# EasyEDA Pro project AE.eprj

# Schematic esquematico-controladora
Board Name: Controladora; Create Date: 2026-03-11; Page Name: FolhaControladora; Project Name: AE; Schematic Name: esquematico-controladora; Update Date: 2026-03-11; Company: EasyEDA.com; Page Size: A4; Version: V1.0
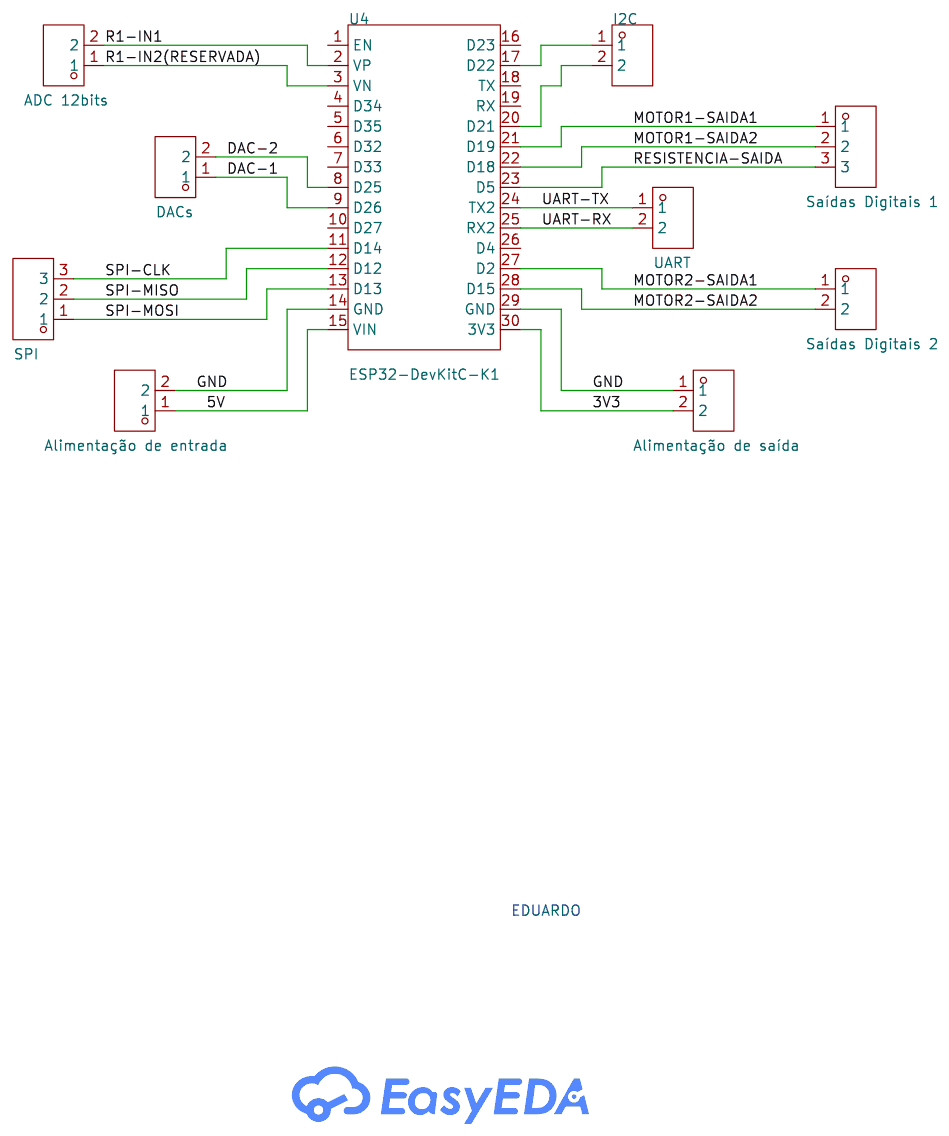
[diagram p0: schematic sheet]

## Parts
ADC12bits  ADC 12bits  [CONN-TH_P5.08_KF128L-5.08-2P]
Alimentaçãodeentrada  Alimentação de entrada  [CONN-TH_P5.08_KF128L-5.08-2P]
Alimentaçãodesaída  Alimentação de saída  [CONN-TH_P5.08_KF128L-5.08-2P]
DACs  DACs  [CONN-TH_P5.08_KF128L-5.08-2P]
I2C  I2C  [CONN-TH_P5.08_KF128L-5.08-2P]
SaídasDigitais1  Saídas Digitais 1  [CONN-TH_3P-P5.00_KF128-5.0-3P]
SaídasDigitais2  Saídas Digitais 2  [CONN-TH_P5.08_KF128L-5.08-2P]
SPI  SPI  [CONN-TH_3P-P5.00_KF128-5.0-3P]
U4  ESP32-DevKitC-K1  [BULETM-SMD_ESP32-DEVKITC]
UART  UART  [CONN-TH_P5.08_KF128L-5.08-2P]

## Library data of the parts
ADC12bits Alimentaçãodeentrada Alimentaçãodesaída DACs I2C SaídasDigitais2 UART = KF128L-5.08-2P: LCSC Part Name: 1x2P 5.08mm 直插 排数:1 每排P数:2; Supplier Part: C474940; Manufacturer: KEFA(科发); Supplier Footprint: 插件,P=5.08mm; JLCPCB Part Class: Extended Part; Datasheet: https://item.szlcsc.com/datasheet/KF128L-5.08-2P/481558.html; Supplier: LCSC; Number of Positions or Pins: 1x2P; Pitch: 5.08mm; Color: Green; Mounting Type: Through Hole; Number of Pins: 2P; Number of Rows: 1; Number of PINs Per Row: 2; Current Rating: 24A; Voltage Rating (Max): 250V; Wire Gauge - AWG: 12~22; Wire Gauge - mm2: 2.5; Operating Temperature: -40℃~+105℃
SaídasDigitais1 = KF128-5.0-3P: LCSC Part Name: 1x3P 5mm 直插 排数:1 每排P数:3; Supplier Part: C474951; Manufacturer: KEFA(科发); Manufacturer Part: SPI; Supplier Footprint: 插件,P=5mm; JLCPCB Part Class: Extended Part; Datasheet: https://item.szlcsc.com/datasheet/KF128-5.0-3P/481569.html; Supplier: LCSC; Number of Positions or Pins: 1x3P; Pitch: 5mm; Color: Green; Mounting Type: Through Hole; Number of Pins: 3P; Number of Rows: 1; Number of PINs Per Row: 3; Current Rating: 24A; Voltage Rating (Max): 250V; Wire Gauge - AWG: 12~22; Wire Gauge - mm2: 2.5; Operating Temperature: -40℃~+105℃
SPI = KF128-5.0-3P: LCSC Part Name: 1x3P 5mm 直插 排数:1 每排P数:3; Supplier Part: C474951; Manufacturer: KEFA(科发); Supplier Footprint: 插件,P=5mm; JLCPCB Part Class: Extended Part; Datasheet: https://item.szlcsc.com/datasheet/KF128-5.0-3P/481569.html; Supplier: LCSC; Number of Positions or Pins: 1x3P; Pitch: 5mm; Color: Green; Mounting Type: Through Hole; Number of Pins: 3P; Number of Rows: 1; Number of PINs Per Row: 3; Current Rating: 24A; Voltage Rating (Max): 250V; Wire Gauge - AWG: 12~22; Wire Gauge - mm2: 2.5; Operating Temperature: -40℃~+105℃
U4 = ESP32-DevKitC: CPU:- ROM Size:- Number of I/O: USB:- WIFI Protocols:- Bluetooth:- Ethernet:- Audio & Video Interface:- Multimedia Support:- Card Type:- Power Supply Type:- Power Supply:- POE Support:- Resolution:- Temperature Range:-; LCSC Part Name: 开发板; Supplier Part: C571180; Manufacturer: ESPRESSIF(乐鑫); JLCPCB Part Class: Extended Part; Datasheet: https://atta.szlcsc.com/upload/public/pdf/source/20200521/C529586_D6FCDAFCFF160B3EDDF7DF28D600699D.pdf; Supplier: LCSC

## Nets
3V3: Alimentaçãodesaída.2 U4.30(3V3)
5V: Alimentaçãodeentrada.1 U4.15(VIN)
GND: Alimentaçãodeentrada.2 Alimentaçãodesaída.1 U4.14(GND) U4.29(GND)
DAC-1: DACs.1 U4.9(D26)
DAC-2: DACs.2 U4.8(D25)
MOTOR1-SAIDA1: SaídasDigitais1.1 U4.21(D19)
MOTOR1-SAIDA2: SaídasDigitais1.2 U4.22(D18)
MOTOR2-SAIDA1: SaídasDigitais2.1 U4.27(D2)
MOTOR2-SAIDA2: SaídasDigitais2.2 U4.28(D15)
R1-IN1: ADC12bits.2 U4.2(VP)
R1-IN2(RESERVADA): ADC12bits.1 U4.3(VN)
RESISTENCIA-SAIDA: SaídasDigitais1.3 U4.23(D5)
SPI-CLK: SPI.3 U4.11(D14)
SPI-MISO: SPI.2 U4.12(D12)
SPI-MOSI: SPI.1 U4.13(D13)
UART-RX: U4.25(RX2) UART.2
UART-TX: U4.24(TX2) UART.1
$1N2586: I2C.1 U4.17(D22)
$1N2592: I2C.2 U4.20(D21)

Not connected (* = marked no-connect by the designer): U4 1(EN) 4(D34) 5(D35) 6(D32) 7(D33) 10(D27) 16(D23) 18(TX) 19(RX) 26(D4)

## Notes on the sheet
- EDUARDO

# Schematic Condicionador
Board Name: PCB5; Create Date: 2026-06-05; Page Name: FolhaCondicionador; Project Name: AE; Schematic Name: Condicionador; Update Date: 2026-06-12; Company: EasyEDA.com; Page Size: A4; Version: V1.0
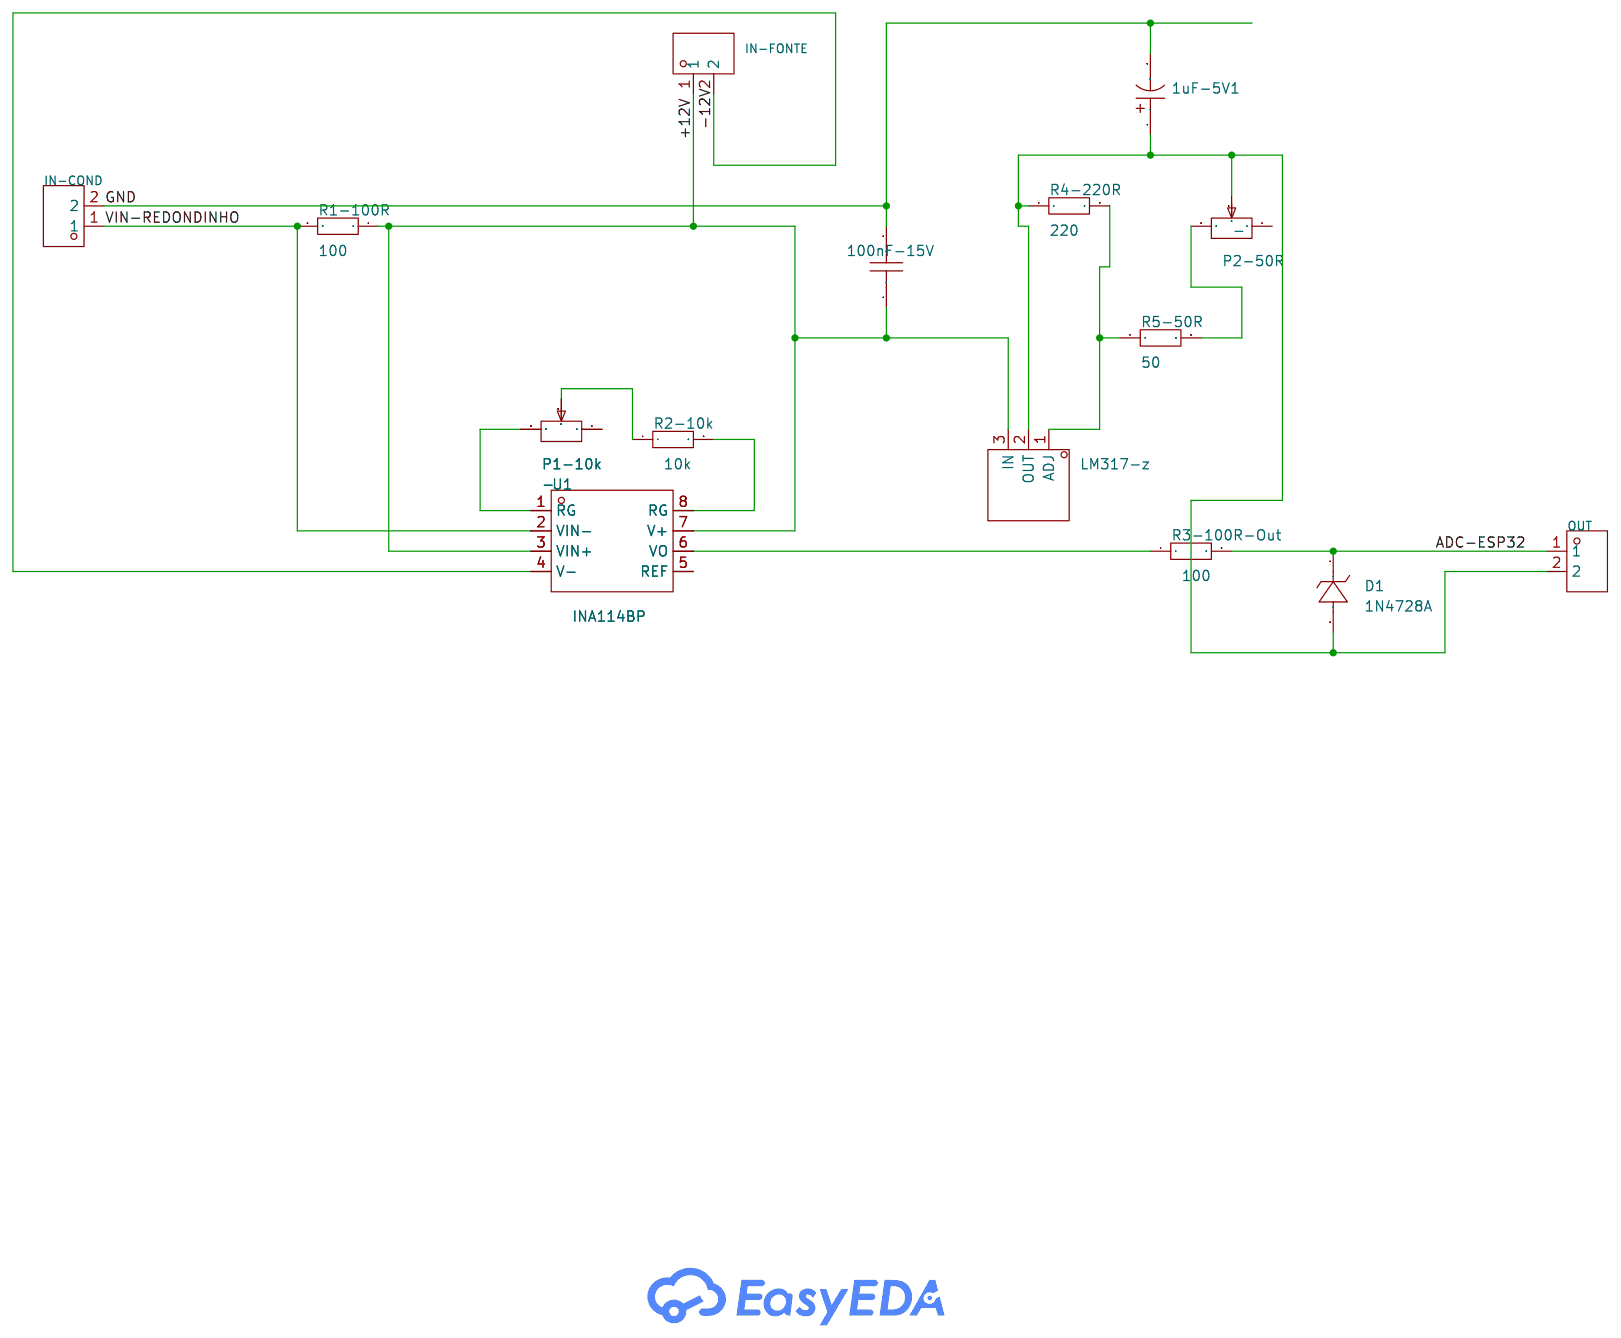
[diagram p1: schematic sheet]

## Parts
1uF-5V1  47uF  [CAP-TH_BD6.3-P2.50-D0.6-FD-H11.0]
100nF-15V  TCC0805X7R106K160FTM  [C0805]
D1  1N4728A  [DO-41_BD2.4-L4.7-P8.70-D0.9-RD]
IN-COND  KF128L-5.08-2P  [CONN-TH_P5.08_KF128L-5.08-2P]
IN-FONTE  KF128L-5.08-2P  [CONN-TH_P5.08_KF128L-5.08-2P]
LM317-z  LM317  [TO-220-3_L10.0-W4.5-P2.54-L]
OUT  KF128L-5.08-2P  [CONN-TH_P5.08_KF128L-5.08-2P]
P1-10k  -  [RES-ADJ-TH_3296W]
P2-50R  -  [RES-ADJ-TH_3296W]
R1-100R  100  [R0603]
R2-10k  10k  [R0603]
R3-100R-Out  100  [R0603]
R4-220R  220  [R0603]
R5-50R  50  [R0603]
U1  INA114BP  [PDIP-8_L9.3-W6.4-P2.54-LS7.6-BL]

## Library data of the parts
1uF-5V1 = KS63V47M6X11: LCSC Part Name: 47uF ±20% 63V; Supplier Part: C54780432; Manufacturer: JIERR(捷而瑞); Supplier Footprint: 插件,D6.3xL11mm; JLCPCB Part Class: Extended Part; Datasheet: https://item.szlcsc.com/datasheet/KS63V47M6X11/58206210.html; Supplier: LCSC; Tolerance: ±20%; Voltage Rating: 63V; Ripple Current: 290mA@100kHz; Equivalent Series Resistance(ESR): 350mΩ@100kHz; Pin Spacing: 2.5mm; Diameter: 6.3mm; Height - Seated (Max): 11mm; Lifetime: 3000hrs@105℃; Operating Temperature: -40℃~+105℃
100nF-15V = TCC0805X7R106K160FTM: Supplier Part: C51902303; Manufacturer: CCTC(三环); Supplier Footprint: 0805; JLCPCB Part Class: Extended Part; Datasheet: https://item.szlcsc.com/datasheet/TCC0805X7R106K160FTM/54593344.html; Supplier: LCSC
D1 = 1N4728A_C7441074: LCSC Part Name: 耐压:3.3V 电流:100uA@1V; Supplier Part: C7441074; Manufacturer: XCH(旭昌辉); Supplier Footprint: DO-41; JLCPCB Part Class: Extended Part; Datasheet: https://item.szlcsc.com/datasheet/1N4728A/8465179.html; Supplier: LCSC; Zener Voltage(Nom): 3.3V; Reverse Leakage Current (Ir): 100uA@1V; Zener Voltage(Range): 3.14V~3.47V; Pd - Power Dissipation: 1W; Impedance(Zzt): 10Ω; Impedance(Zzk): 400Ω; Operating Junction Temperature Range: -55℃~+150℃
IN-COND IN-FONTE OUT = KF128L-5.08-2P: LCSC Part Name: 1x2P 5.08mm 直插 排数:1 每排P数:2; Supplier Part: C474940; Manufacturer: KEFA(科发); Supplier Footprint: 插件,P=5.08mm; JLCPCB Part Class: Extended Part; Datasheet: https://item.szlcsc.com/datasheet/KF128L-5.08-2P/481558.html; Supplier: LCSC; Number of Positions or Pins: 1x2P; Pitch: 5.08mm; Color: Green; Mounting Type: Through Hole; Number of Pins: 2P; Number of Rows: 1; Number of PINs Per Row: 2; Current Rating: 24A; Voltage Rating (Max): 250V; Wire Gauge - AWG: 12~22; Wire Gauge - mm2: 2.5; Operating Temperature: -40℃~+105℃
LM317-z = LM317: LCSC Part Name: ADJ 输出1.2V~37V 2.2A; Supplier Part: C358377; Manufacturer: BLUE ROCKET(蓝箭); Supplier Footprint: TO-220; JLCPCB Part Class: Extended Part; Datasheet: https://atta.szlcsc.com/upload/public/pdf/source/20190129/C358377_320697A0243575D6E7F47A89E37E80CE.pdf; Supplier: LCSC; Output Voltage: 1.2V~37V; MAX Output Current: 2.2A; Power Supply Rejection Ratio (PSRR): 80dB@(120Hz); Output Polarity: Positive electrode; Number of Outputs: 1
P1-10k P2-50R = 精密可调电阻 3296W-1-304(300K): LCSC Part Name: 3296W-1-304(300K); Supplier Part: C62174; Supplier Footprint: VR-3296W; JLCPCB Part Class: Extended Part; Supplier: LCSC
R1-100R R2-10k R3-100R-Out R4-220R R5-50R = Res_0603: Supplier Footprint: 0603
U1 = INA114BP: Supplier Part: C472483; Manufacturer: TI(德州仪器); Supplier Footprint: PDIP-8; JLCPCB Part Class: Extended Part; Datasheet: https://www.ti.com/cn/lit/gpn/ina114; Supplier: LCSC; Number of Channels: 1; Common Mode Rejection Ratio(CMRR): 115dB; Ib - Input Bias Current: 2nA; Vos - Input Offset Voltage: 50uV; Slew Rate: 1V/us; Output Current: 5mA; Quiescent Current(Iq): 3mA; Input Offset Voltage Drift(Vos TC): 250nV/℃; Operating Temperature: -40℃~+85℃

## Nets
+12V: 100nF-15V.1 IN-FONTE.1 LM317-z.3(IN) R1-100R.1 U1.3(VIN+) U1.7(V+)
-12V: IN-FONTE.2 U1.4(V-)
GND: 1uF-5V1.2 100nF-15V.2 IN-COND.2
VIN-REDONDINHO: IN-COND.1 R1-100R.2 U1.2(VIN-)
ADC-ESP32: D1.1(K) OUT.1 R3-100R-Out.2
$1N832: P1-10k.3 U1.1(RG)
$1N841: R2-10k.2 U1.8(RG)
$1N855: P1-10k.2 R2-10k.1
$1N2660: R3-100R-Out.1 U1.6(VO)
Net-(1uF-5V1-1): 1uF-5V1.1 D1.2(A) LM317-z.2(OUT) OUT.2 P2-50R.2 R4-220R.1
Net-(LM317-z-1): LM317-z.1(ADJ) R4-220R.2 R5-50R.1
Net-(P2-50R-3): P2-50R.3 R5-50R.2

Not connected (* = marked no-connect by the designer): P1-10k 1; P2-50R 1; U1 5(REF)

# Board PCB-controladora
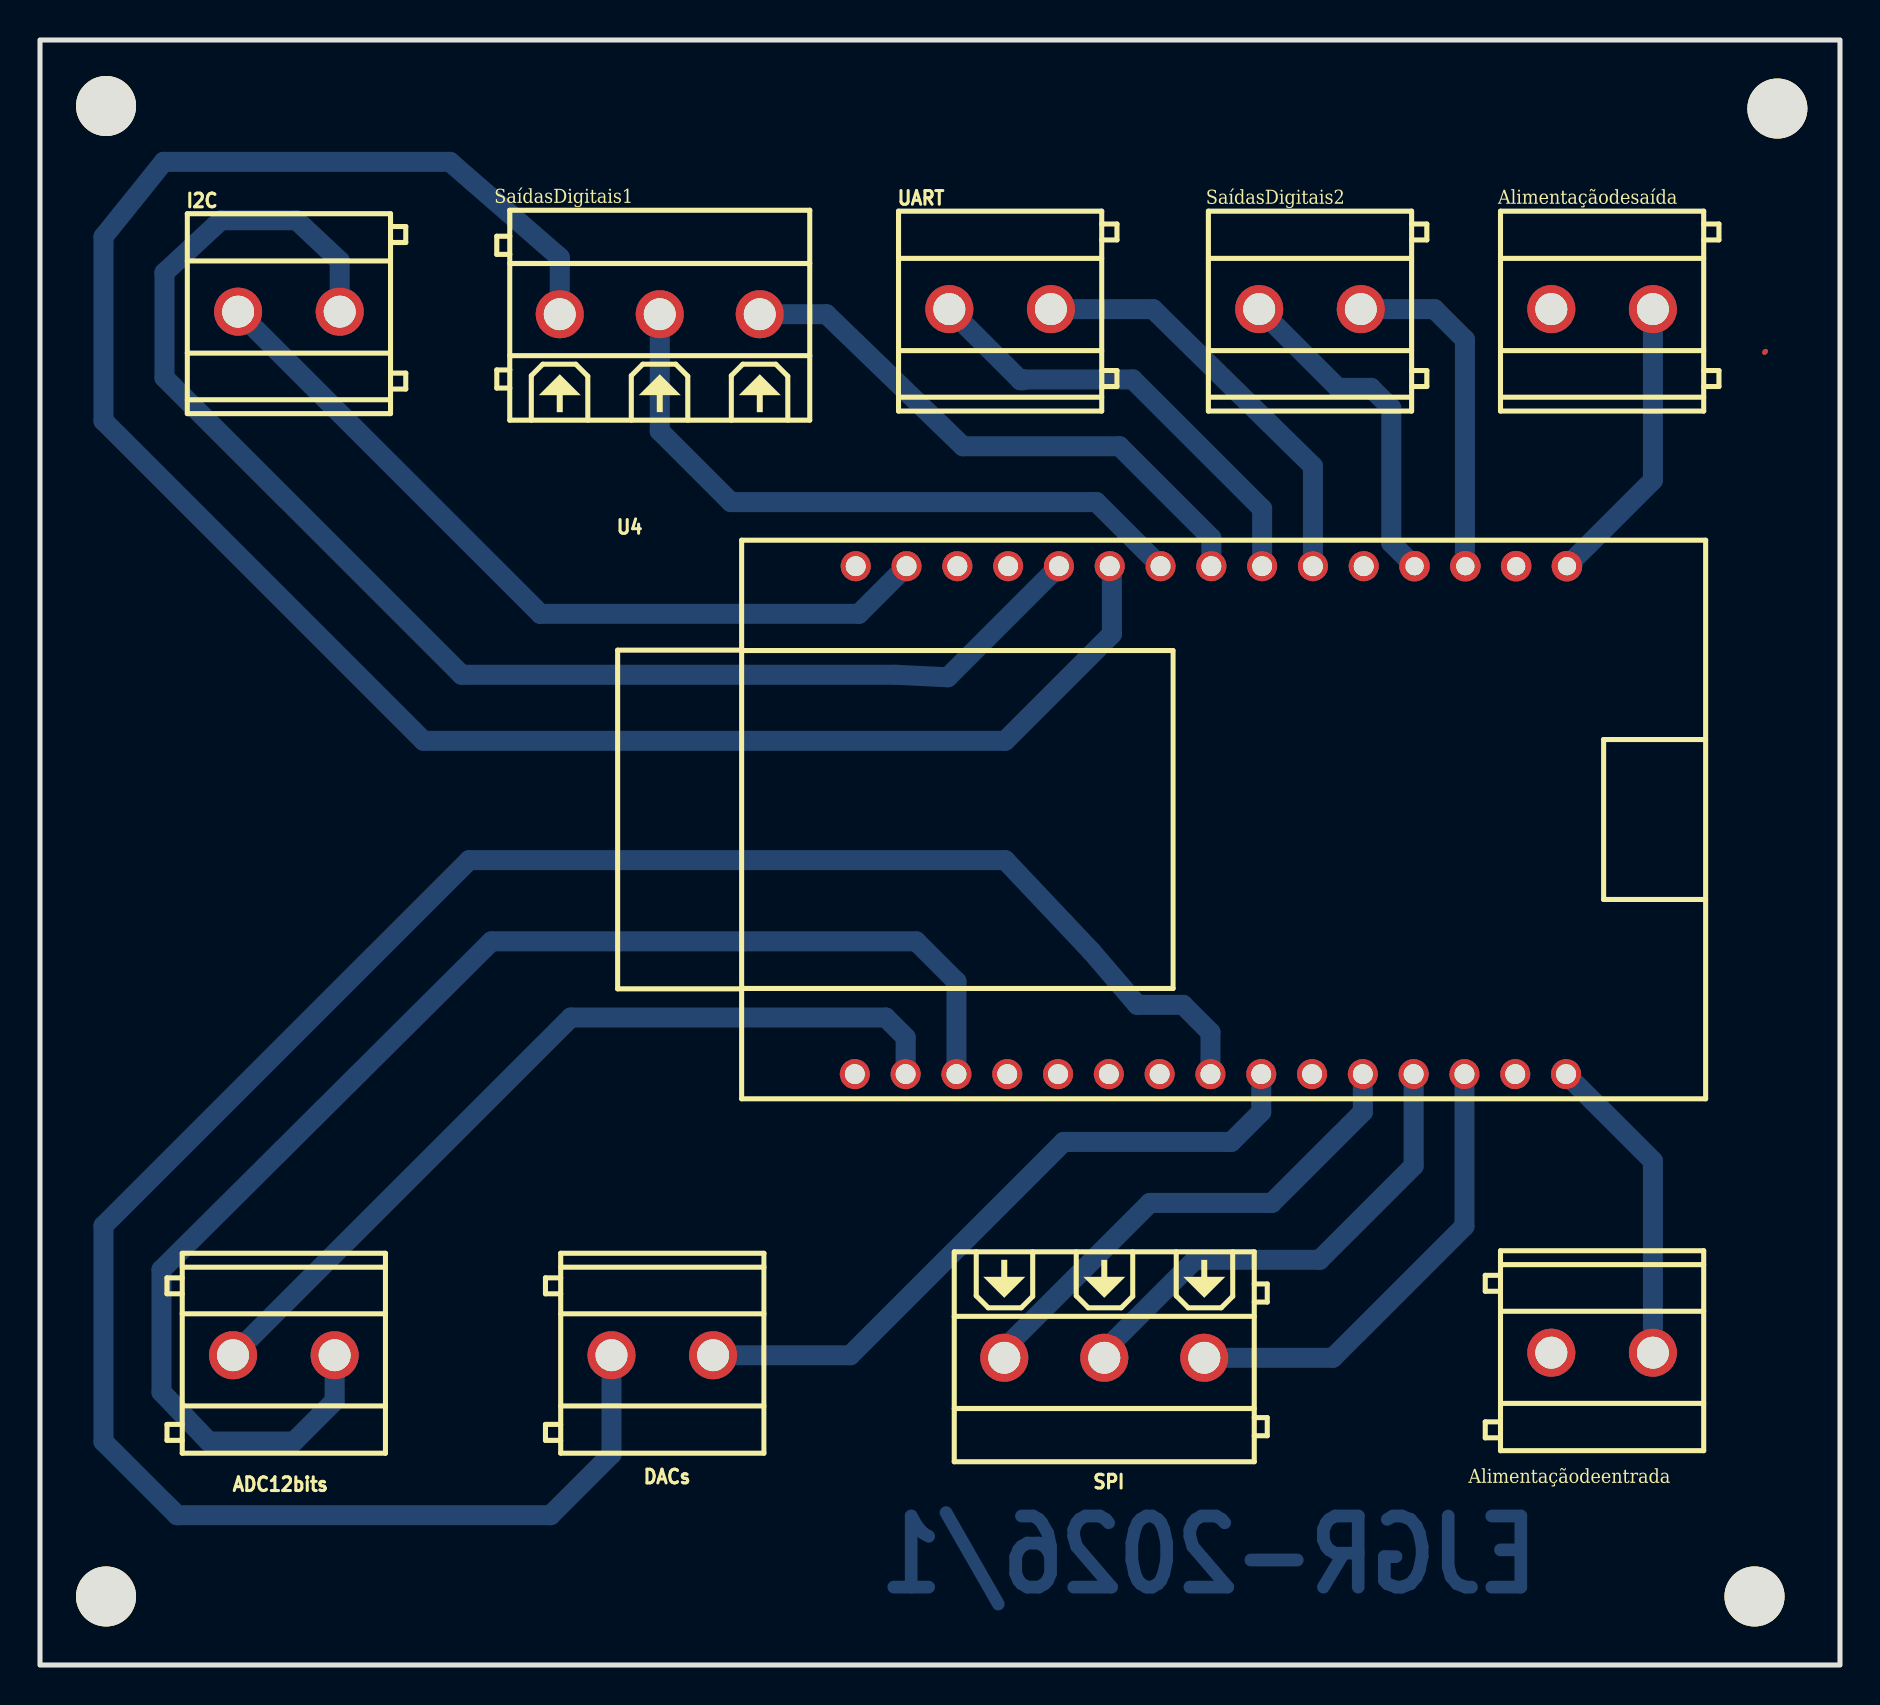
[diagram p2: board, top side]
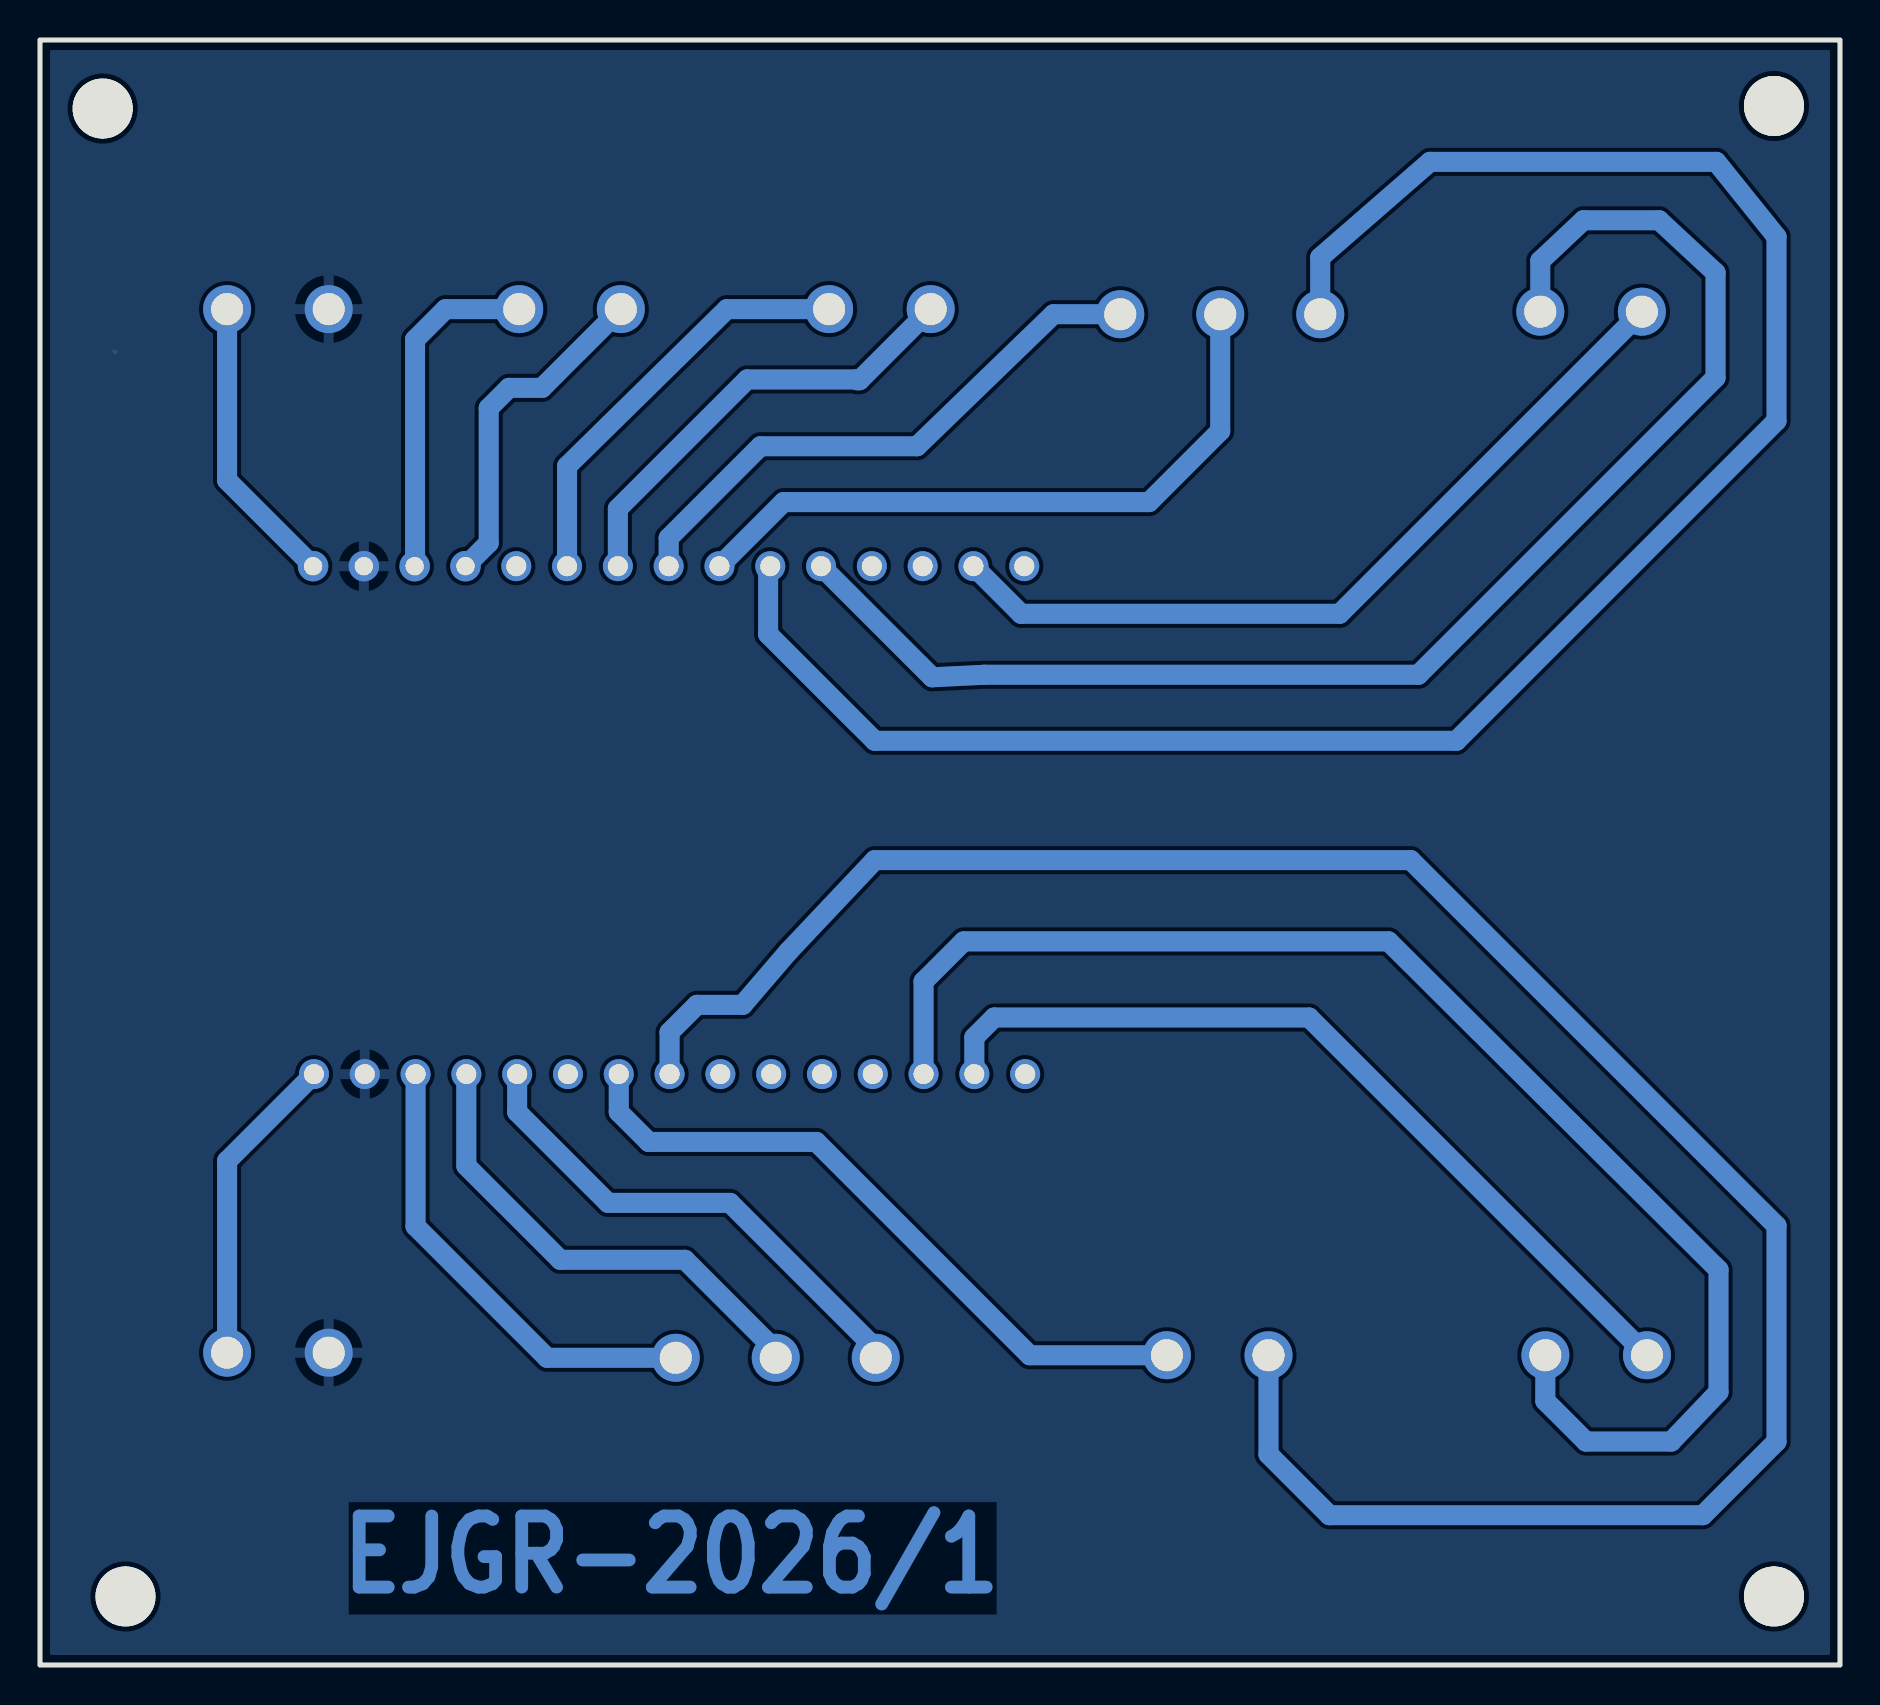
[diagram p3: board, bottom side, seen from below]

Outline 90 x 81.28 mm; copper layers: Top Layer, Bottom Layer. Coordinates in mm from the lower left corner of the outline.
Outline path: rectangle 0,81.28 90,0
Stack: Top Layer 0.035mm / Dielectric1 1.51mm FR4 er 4.5 / Bottom Layer 0.035mm

## Design rules (mm)
template: Custom Config
spacing copperThickness1oz (default): track to track 0.102, other pairs 0.152 to 0.3
spacing copperThickness2oz: track to track 0.203, other pairs 0.152 to 0.3
track width copperThickness1oz (default): min 0.127, default 0.254, max 2.54
track width copperThickness2oz: min 0.203, default 0.254, max 2.54
differential pair differentialPair (default): width min 0.127, default 0.254, max 2.54; gap min 0.152, default 0.152
via viaSize (default): diameter min 0.5, default 0.61, max 10; hole min 0.3, default 0.305, max 6.3
pour e336 uses copperRegion

## Placement (name value [footprint] x y rotation side)
ADC12bits  ADC 12bits  [CONN-TH_P5.08_KF128L-5.08-2P]  12.19 15.49 180 top
Alimentaçãodeentrada  Alimentação de entrada  [CONN-TH_P5.08_KF128L-5.08-2P]  78.1 15.62 180 top
Alimentaçãodesaída  Alimentação de saída  [CONN-TH_P5.08_KF128L-5.08-2P]  78.1 67.82 0 top
DACs  DACs  [CONN-TH_P5.08_KF128L-5.08-2P]  31.12 15.49 180 top
I2C  I2C  [CONN-TH_P5.08_KF128L-5.08-2P]  12.45 67.69 0 top
NOREF  -  [Pad_e24]  85.72 3.43 0 top
NOREF#2  -  [Pad_e23]  3.3 3.43 0 top
NOREF#3  -  [Pad_e17]  3.3 77.98 0 top
NOREF#4  -  [Pad_e22]  86.87 77.85 0 top
SaídasDigitais1  Saídas Digitais 1  [CONN-TH_3P-P5.00_KF128-5.0-3P]  30.99 67.56 0 top
SaídasDigitais2  Saídas Digitais 2  [CONN-TH_P5.08_KF128L-5.08-2P]  63.5 67.82 0 top
SPI  SPI  [CONN-TH_3P-P5.00_KF128-5.0-3P]  53.21 15.37 180 top
U4  ESP32-DevKitC-K1  [BULETM-SMD_ESP32-DEVKITC]  59.18 42.29 0 top
UART  UART  [CONN-TH_P5.08_KF128L-5.08-2P]  48.01 67.82 0 top

## Footprints (pads in the part's own frame, mm; a bottom-side part is the same pattern mirrored in y, then rotated)
BULETM-SMD_ESP32-DEVKITC
  round 1.5 hole 1: 1(-18.44,-12.735) 2(-15.9,-12.735) 3(-13.36,-12.735) 4(-10.82,-12.735) 5(-8.28,-12.735) 6(-5.74,-12.735) 7(-3.2,-12.735) 8(-0.66,-12.735) 9(1.88,-12.735) 10(4.42,-12.735) 11(6.96,-12.735) 12(9.5,-12.735) 13(12.04,-12.735) 14(14.58,-12.735) 15(17.12,-12.735) 16(-18.395,12.67) 17(-15.855,12.67) 18(-13.315,12.67) 19(-10.775,12.67) 20(-8.235,12.67) 21(-5.695,12.67) 22(-3.155,12.67) 23(-0.615,12.67) 24(1.925,12.67) 25(4.465,12.67) 26(7.005,12.67)
  round 1.524 hole 0.914: 27(9.545,12.67) 28(12.085,12.67) 29(14.625,12.67) 30(17.165,12.67)
CONN-TH_3P-P5.00_KF128-5.0-3P
  round 2.4 hole 1.6: 1(-5,0) 2(0,0) 3(5,0)
CONN-TH_P5.08_KF128L-5.08-2P
  round 2.4 hole 1.6: 1(-2.54,0) 2(2.54,0)
Pad_e17
  round 3 hole 3x2.5: 1(0,0)
Pad_e22
  round 3 hole 3x2.5: 1(0,0)
Pad_e23
  round 3 hole 3x2.5: 1(0,0)
Pad_e24
  round 3 hole 3x2.5: 1(0,0)

## Nets
As in the schematic.

Pads without a net: NOREF 1; NOREF#2 1; NOREF#3 1; NOREF#4 1; U4 1 4 5 6 7 10 16 18 19 26

## Routing (per net, layer and track width the routed paths; a pad name or vN(x,y) marks a point on that pad's centre or on a via; arc(x,y) is an arc through that point)
3V3: length 14.6
  Bottom Layer w1.001: Alimentaçãodesaída.2 80.65,59.26 76.35,54.96
5V: length 15.7
  Bottom Layer w1.001: U4.15 80.65,25.21 Alimentaçãodeentrada.1
DAC-1: length 34.3
  Bottom Layer w1.001: DACs.1 40.51,15.49 51.18,26.16 59.56,26.16 61.06,27.66 U4.9
DAC-2: length 112.7
  Bottom Layer w1.001: 28.57,15.49 28.57,10.54 25.53,7.49 6.86,7.49 3.17,11.18 3.17,21.97 21.46,40.26 48.26,40.26 52.58,35.69 54.86,33.02 57.15,33.02 58.52,31.65 U4.8
MOTOR1-SAIDA1: length 101.1
  Bottom Layer w1.001: SaídasDigitais1.1 25.99,70.41 20.5,75.18 6.18,75.18 3.17,71.44 3.17,62.23 19.18,46.23 48.26,46.23 53.59,51.56 53.59,54.85 U4.21
MOTOR1-SAIDA2: length 33.7
  Bottom Layer w1.001: SaídasDigitais1.2 30.99,61.72 34.54,58.17 52.82,58.17 U4.22
MOTOR2-SAIDA1: length 17
  Bottom Layer w1.001: SaídasDigitais2.1 64.9,63.88 66.55,63.88 67.56,62.86 67.56,56.12 68.73,54.96
MOTOR2-SAIDA2: length 17.2
  Bottom Layer w1.001: SaídasDigitais2.2 69.72,67.82 71.25,66.29 71.25,54.98 U4.28
R1-IN1: length 42.9
  Bottom Layer w1.001: ADC12bits.2 26.54,32.39 42.29,32.39 43.28,31.39 U4.2
R1-IN2(RESERVADA): length 71
  Bottom Layer w1.001: ADC12bits.1 14.73,13.21 12.7,11.18 8.44,11.18 6.07,13.66 6.07,19.77 22.57,36.2 43.81,36.2 45.82,34.19 U4.3
RESISTENCIA-SAIDA: length 28.6
  Bottom Layer w1.001: SaídasDigitais1.3 39.32,67.56 46.15,60.96 53.97,60.96 58.57,56.37 58.57,54.96
SPI-CLK: length 25.2
  Bottom Layer w1.001: SPI.3 48.21,15.83 55.5,23.11 61.59,23.11 66.14,27.66 U4.11
SPI-MISO: length 23.9
  Bottom Layer w1.001: 53.22,15.74 57.75,20.27 63.98,20.27 68.68,24.97 U4.12
SPI-MOSI: length 23.3
  Bottom Layer w1.001: SPI.1 64.64,15.37 71.22,21.95 U4.13
UART-RX: length 21.3
  Bottom Layer w1.001: UART.2 55.65,67.82 63.65,59.96 U4.25
UART-TX: length 22.7
  Bottom Layer w1.001: UART.1 49.02,64.26 49.15,64.26 49.19,64.3 54.64,64.3 61.11,57.83 U4.24
$1N2586: length 40.7
  Bottom Layer w1.001: I2C.1 25.02,52.58 40.94,52.58 U4.17
$1N2592: length 71.6
  Bottom Layer w1.001: I2C.2 14.99,70.23 12.83,72.26 9.05,72.26 6.22,69.64 6.22,64.39 21.08,49.53 42.8,49.53 45.39,49.4 U4.20

## Copper pours and planes (outline as drawn; the poured copper is in the pictures)
GND on Bottom Layer: -0.13,81.41 89.87,81.41 89.87,0.13 -0.13,0.13
GND on Bottom Layer: 0,81.28 90,81.28 90,0 0,0

## Text on the board
Bottom Layer: EJGR-2026/1

# Board PCBControladora
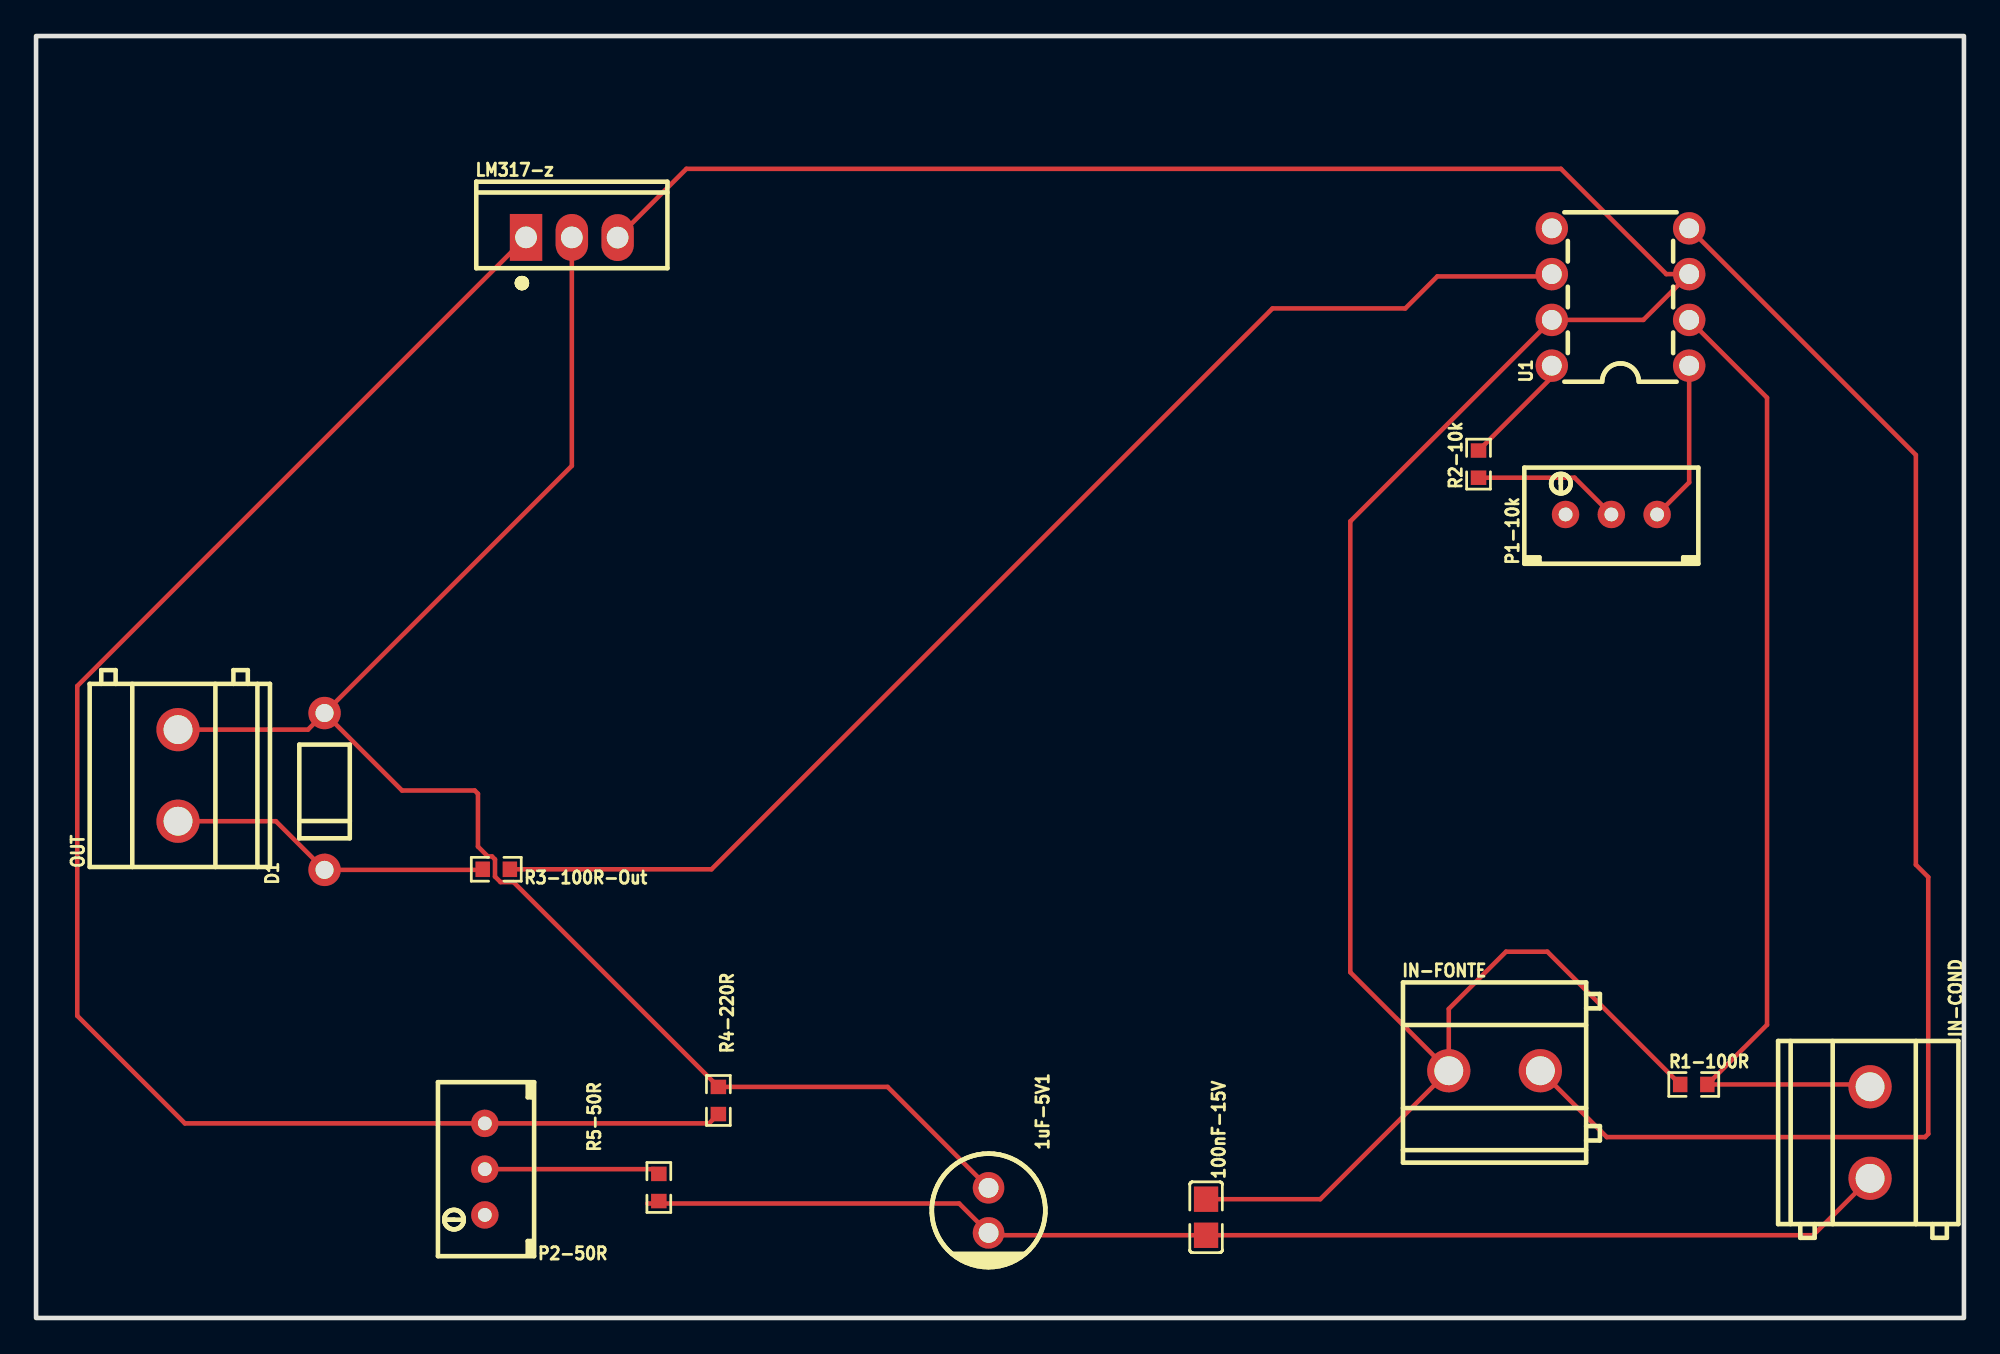
[diagram p4: board, top side]
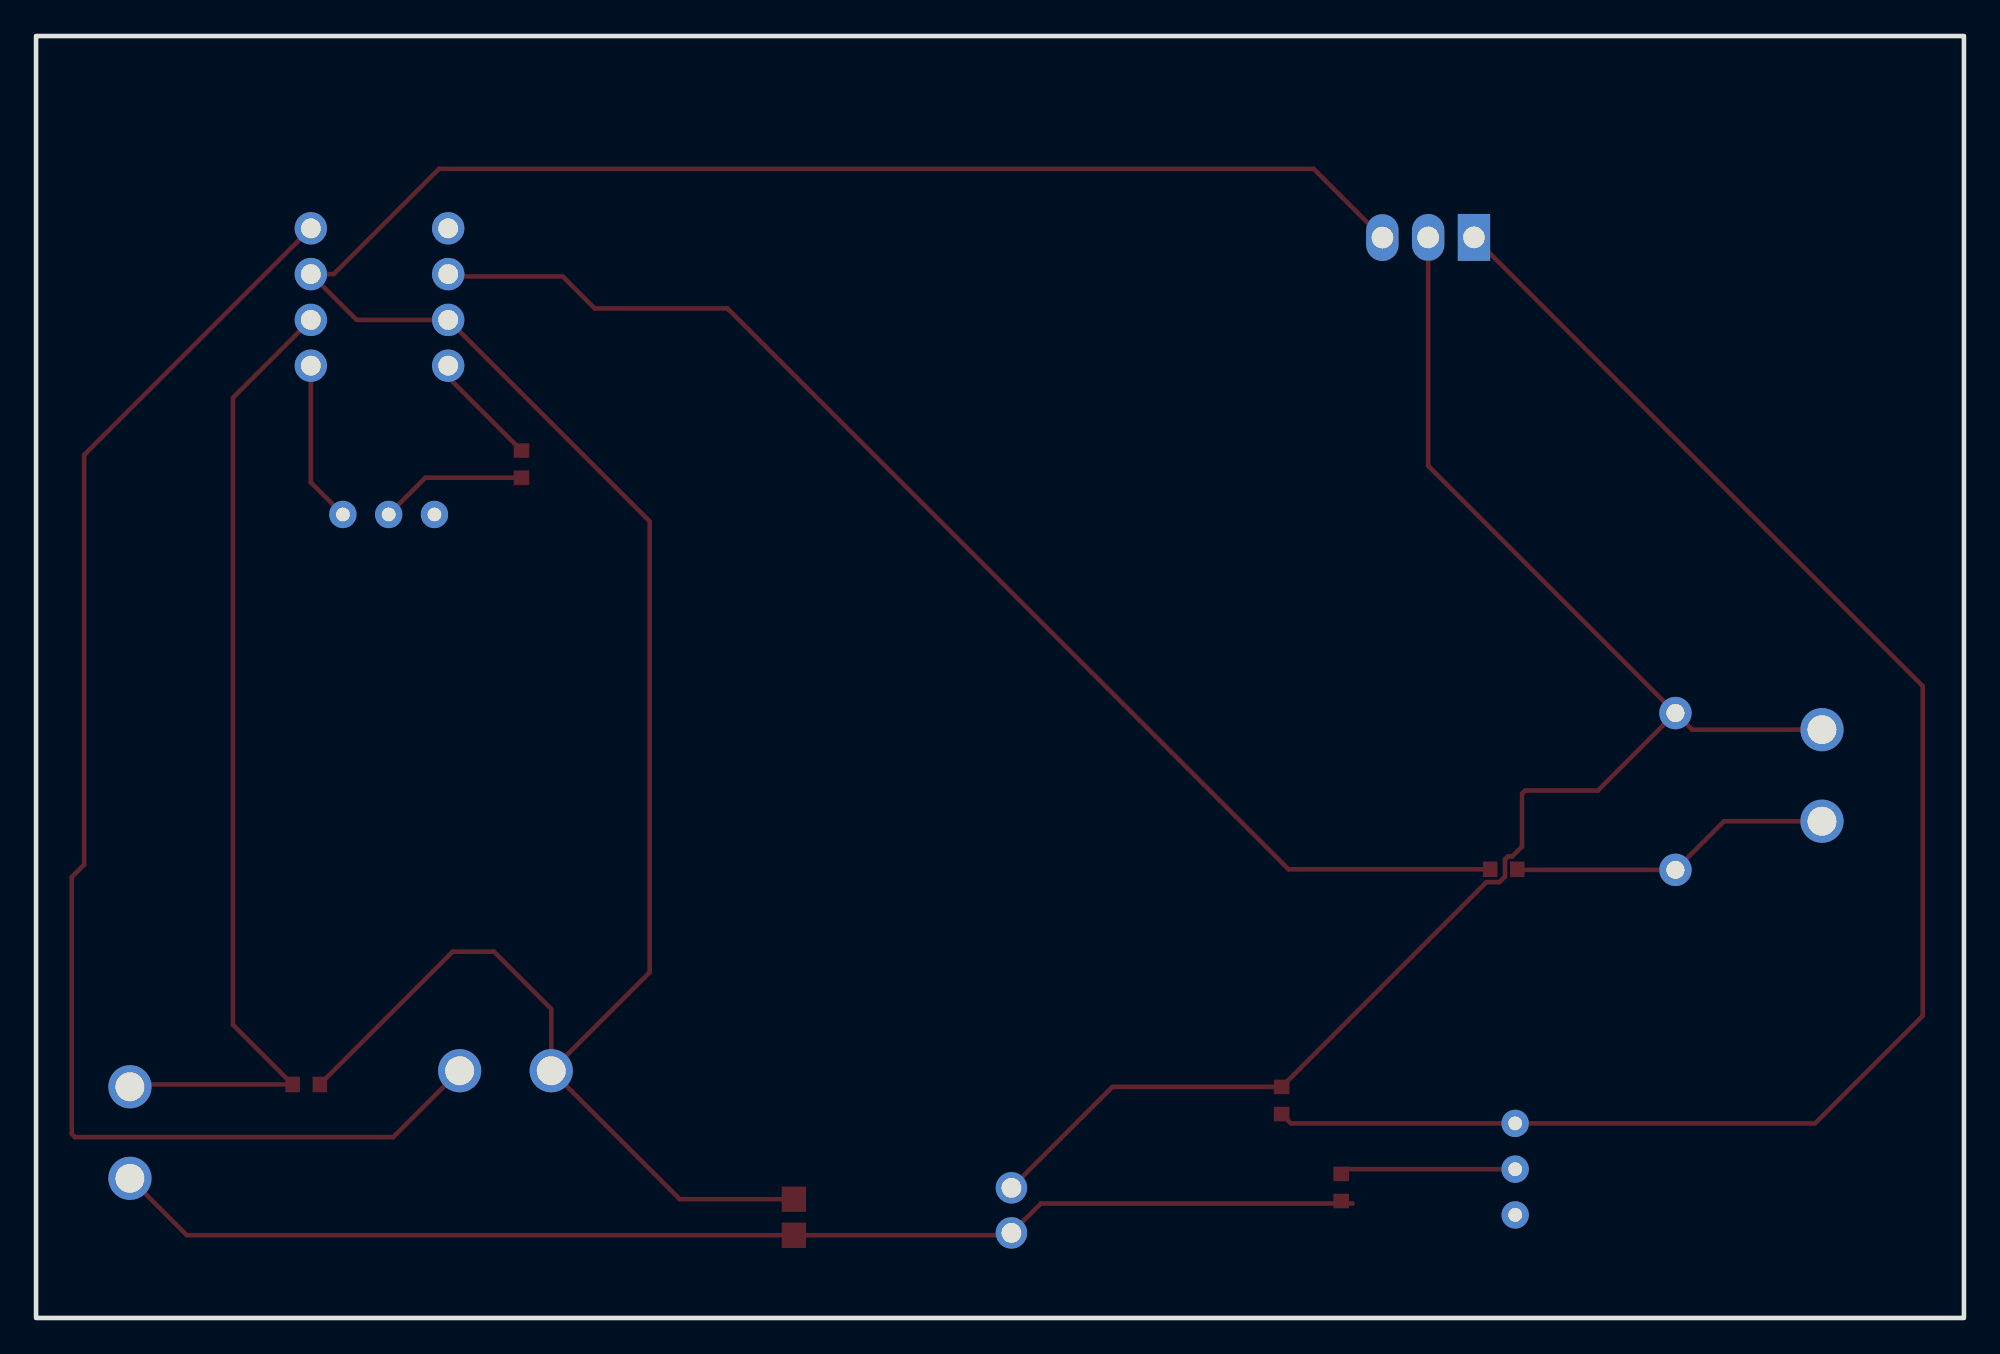
[diagram p5: board, bottom side, seen from below]

Outline 106.93 x 71.12 mm; copper layers: Top Layer, Bottom Layer. Coordinates in mm from the lower left corner of the outline.
Outline path: rectangle 0,71.12 106.93,0
Stack: Top Layer 0.035mm / Dielectric1 1.51mm FR4 er 4.5 / Bottom Layer 0.035mm

## Design rules (mm)
template: JLCPCB Capability(Two Layers Board)
spacing copperThickness1oz (default): track to track 0.102, other pairs 0.152 to 0.3
spacing copperThickness2oz: track to track 0.203, other pairs 0.152 to 0.3
track width copperThickness1oz (default): min 0.127, default 0.254, max 2.54
track width copperThickness2oz: min 0.203, default 0.254, max 2.54
differential pair differentialPair (default): width min 0.127, default 0.254, max 2.54; gap min 0.152, default 0.152
via viaSize (default): diameter min 0.5, default 0.61, max 10; hole min 0.3, default 0.305, max 6.3

## Placement (name value [footprint] x y rotation side)
1uF-5V1  47uF  [CAP-TH_BD6.3-P2.50-D0.6-FD-H11.0]  52.83 5.97 270 top
100nF-15V  TCC0805X7R106K160FTM  [C0805]  64.9 5.59 270 top
D1  1N4728A  [DO-41_BD2.4-L4.7-P8.70-D0.9-RD]  16 29.21 90 top
IN-COND  KF128L-5.08-2P  [CONN-TH_P5.08_KF128L-5.08-2P]  101.73 10.29 270 top
IN-FONTE  KF128L-5.08-2P  [CONN-TH_P5.08_KF128L-5.08-2P]  80.9 13.72 0 top
LM317-z  LM317  [TO-220-3_L10.0-W4.5-P2.54-L]  29.72 59.94 0 top
OUT  KF128L-5.08-2P  [CONN-TH_P5.08_KF128L-5.08-2P]  7.87 30.1 90 top
P1-10k  -  [RES-ADJ-TH_3296W]  87.38 44.58 90 top
P2-50R  -  [RES-ADJ-TH_3296W]  24.89 8.25 180 top
R1-100R  100  [R0603]  91.95 12.95 0 top
R2-10k  10k  [R0603]  80.01 47.37 90 top
R3-100R-Out  100  [R0603]  25.53 24.89 180 top
R4-220R  220  [R0603]  37.85 12.06 270 top
R5-50R  50  [R0603]  34.54 7.24 270 top
U1  INA114BP  [PDIP-8_L9.3-W6.4-P2.54-LS7.6-BL]  87.88 56.64 90 top

## Footprints (pads in the part's own frame, mm; a bottom-side part is the same pattern mirrored in y, then rotated)
C0805
  rect 1.41x1.35 smd: 1(-1,0) 2(1,0)
CAP-TH_BD6.3-P2.50-D0.6-FD-H11.0
  round 1.75 hole 1.1: 1(-1.25,0) 2(1.25,0)
CONN-TH_P5.08_KF128L-5.08-2P
  round 2.4 hole 1.6: 1(-2.54,0) 2(2.54,0)
DO-41_BD2.4-L4.7-P8.70-D0.9-RD
  round 1.8 hole 1: 1(-4.35,0) 2(4.35,0)
PDIP-8_L9.3-W6.4-P2.54-LS7.6-BL
  round 1.8 hole 1.1: 1(-3.81,-3.81) 2(-1.27,-3.81) 3(1.27,-3.81) 4(3.81,-3.81) 5(3.81,3.81) 6(1.27,3.81) 7(-1.27,3.81) 8(-3.81,3.81)
R0603
  rect 0.806x0.864 smd: 1(-0.753,0) 2(0.753,0)
RES-ADJ-TH_3296W
  round 1.524 hole 0.762: 1(0,2.54) 2(0,0) 3(0,-2.54)
TO-220-3_L10.0-W4.5-P2.54-L
  rect 1.8x2.6 hole 1.2: 1(-2.54,0.005)
  oval 1.8x2.6 hole 1.2: 2(0,0.005) 3(2.54,-0.005)

## Nets
+12V: 100nF-15V.1 IN-FONTE.1 LM317-z.3 R1-100R.1 U1.3 U1.7
-12V: IN-FONTE.2 U1.4
GND: 1uF-5V1.2 100nF-15V.2 IN-COND.2 R5-50R.2
VIN-REDONDINHO: IN-COND.1 R1-100R.2 U1.2
ADC-ESP32: D1.1 OUT.1 R3-100R-Out.2
$1N832: P1-10k.3 U1.1
$1N841: R2-10k.2 U1.8
$1N855: P1-10k.2 R2-10k.1
$1N2660: R3-100R-Out.1 U1.6
$1N2722: 1uF-5V1.1 D1.2 LM317-z.2 OUT.2 R4-220R.1
$1N2818: LM317-z.1 P2-50R.3 R4-220R.2
$1N2886: P2-50R.2 R5-50R.1

Pads without a net: P1-10k 1; P2-50R 1; U1 5

## Routing (per net, layer and track width the routed paths; a pad name or vN(x,y) marks a point on that pad's centre or on a via; arc(x,y) is an arc through that point)
+12V: length 157.7
  Top Layer w0.254: LM317-z.3 36.07,63.75 84.58,63.75 90.42,57.91 U1.3 89.15,55.37 U1.7 72.9,44.2 72.9,19.18 IN-FONTE.1 ; IN-FONTE.1 71.23,6.59 100nF-15V.1 ; IN-FONTE.1 78.36,17.14 81.53,20.32 83.83,20.32 R1-100R.1
-12V: length 78.8
  Top Layer w0.254: U1.4 104.27,47.88 104.27,25.15 104.95,24.46 104.95,10.21 104.77,10.03 87.12,10.03 IN-FONTE.2
GND: length 69.9
  Top Layer w0.254: 101.73,7.75 98.57,4.59 100nF-15V.2 52.96,4.59 1uF-5V1.2 51.2,6.35 33.91,6.35
VIN-REDONDINHO: length 54.7
  Top Layer w0.254: U1.2 96.01,51.05 96.01,16.26 R1-100R.2 101.6,12.95 IN-COND.1
ADC-ESP32: length 18
  Top Layer w0.254: R3-100R-Out.2 24.74,24.86 D1.1 13.3,27.56 OUT.1
$1N832: length 9
  Top Layer w0.254: P1-10k.3 91.69,46.35 U1.1
$1N841: length 6.4
  Top Layer w0.254: R2-10k.2 84.07,52.19 U1.8
$1N855: length 8.2
  Top Layer w0.254: R2-10k.1 85.34,46.62 P1-10k.2
$1N2660: length 71.5
  Top Layer w0.254: U1.6 83.95,57.78 77.72,57.78 75.95,56.01 68.58,56.01 37.46,24.89 R3-100R-Out.1
$1N2722: length 90.6
  Top Layer w0.254: 29.72,59.95 29.72,47.28 D1.2 ; D1.2 15.08,32.64 OUT.2 ; D1.2 20.3,29.26 24.33,29.26 24.51,29.08 24.51,26.15 25.06,25.6 25.29,25.6 25.46,25.44 25.46,24.49 25.76,24.18 26.48,24.18 R4-220R.1 47.23,12.82 1uF-5V1.1
$1N2818: length 91.7
  Top Layer w0.254: R4-220R.2 37.33,10.79 P2-50R.3 8.25,10.79 2.29,16.76 2.29,35.06 27.18,59.95
$1N2886: length 9.8
  Top Layer w0.254: P2-50R.2 34.28,8.25 R5-50R.1
